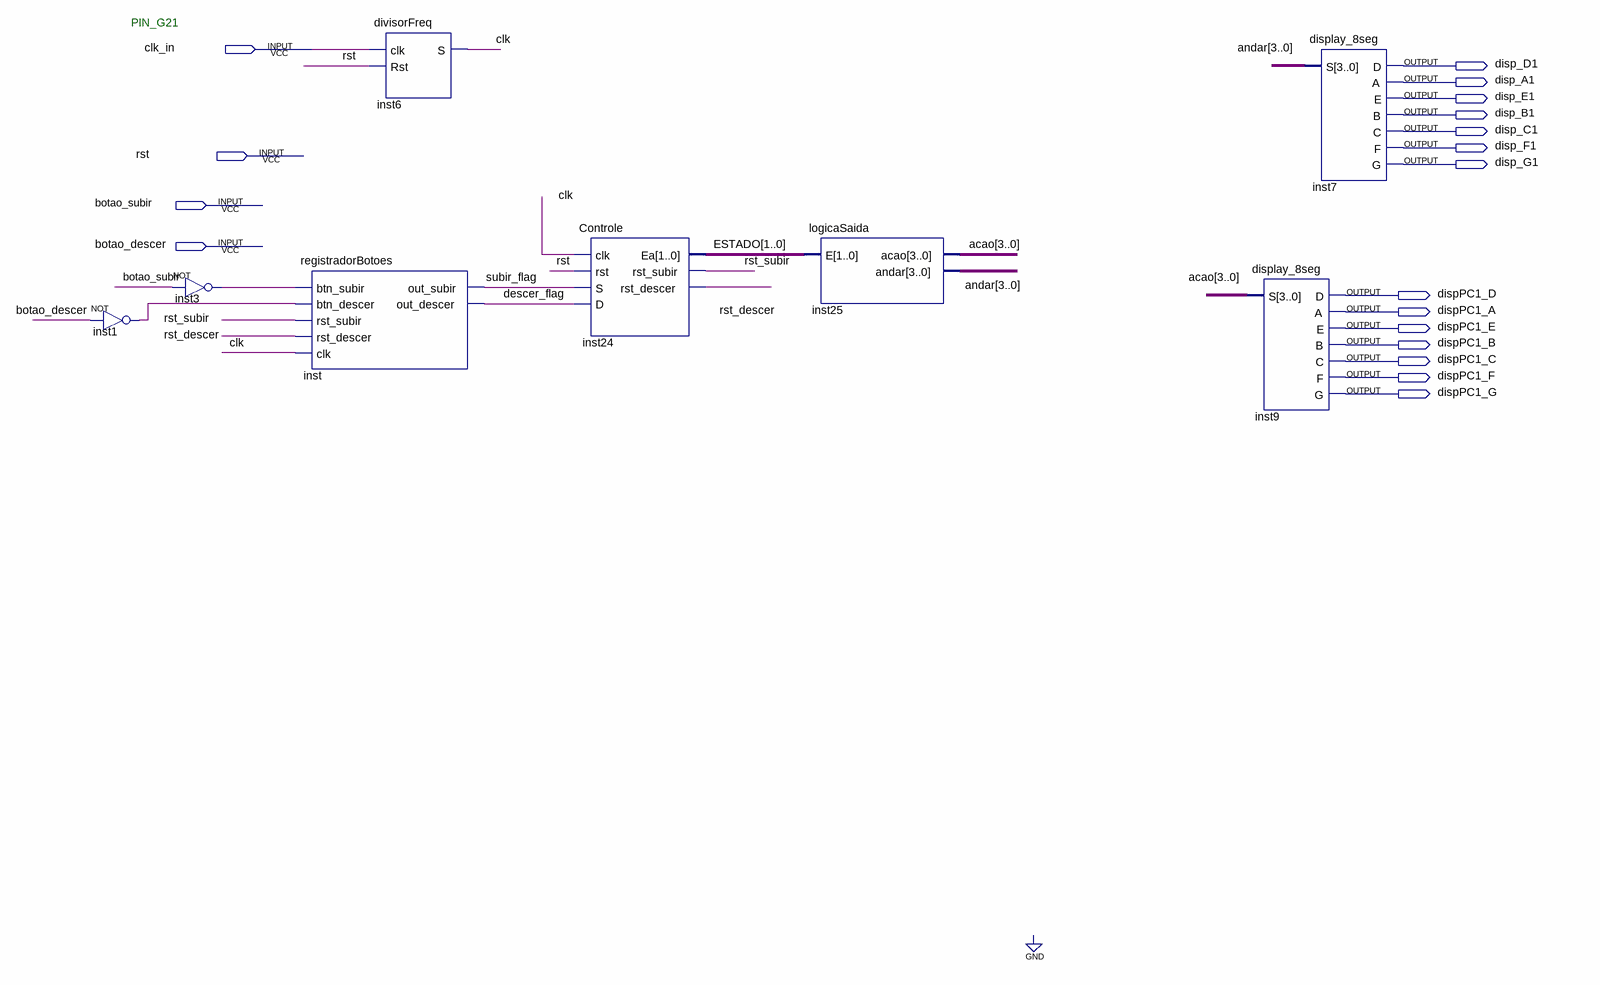
[diagram p0: schematic sheet]
// Quartus schematic FSM_elevador.bdf as structural Verilog: 8 symbols, 18 pins
module FSM_elevador (
  input  clk_in,
  input  rst,
  input  botao_subir,
  input  botao_descer,
  output disp_D1,
  output disp_A1,
  output disp_E1,
  output disp_B1,
  output disp_C1,
  output disp_F1,
  output disp_G1,
  output dispPC1_D,
  output dispPC1_A,
  output dispPC1_E,
  output dispPC1_B,
  output dispPC1_C,
  output dispPC1_F,
  output dispPC1_G
);

  wire clk, descer_flag, inst1_out, inst3_out, rst_descer, rst_subir, subir_flag;
  wire [1:0] ESTADO;
  wire [3:0] acao, andar;

  not inst1 (inst1_out, botao_descer);
  not inst3 (inst3_out, botao_subir);
  registradorBotoes inst (
    .btn_subir(inst3_out), .btn_descer(inst1_out), .rst_subir(rst_subir), .rst_descer(rst_descer), .clk(clk),
    .out_subir(subir_flag), .out_descer(descer_flag));
  divisorFreq inst6 (.clk(clk_in), .Rst(rst), .S(clk));
  Controle inst24 (
    .clk(clk), .rst(rst), .S(subir_flag), .D(descer_flag), .Ea(ESTADO), .rst_subir(rst_subir),
    .rst_descer(rst_descer));
  logicaSaida inst25 (.E(ESTADO), .acao(acao), .andar(andar));
  display_8seg inst9 (
    .S(acao), .D(dispPC1_D), .A(dispPC1_A), .E(dispPC1_E), .B(dispPC1_B), .C(dispPC1_C), .F(dispPC1_F),
    .G(dispPC1_G));
  display_8seg inst7 (
    .S(andar), .D(disp_D1), .A(disp_A1), .E(disp_E1), .B(disp_B1), .C(disp_C1), .F(disp_F1), .G(disp_G1));

  // Notes on the sheet:
  //   PIN_G21
endmodule
